# Altium schematic sheet SENSE_MUXES.SchDoc: =DocumentName
size C; SheetNumber: 5; SheetTotal: 8
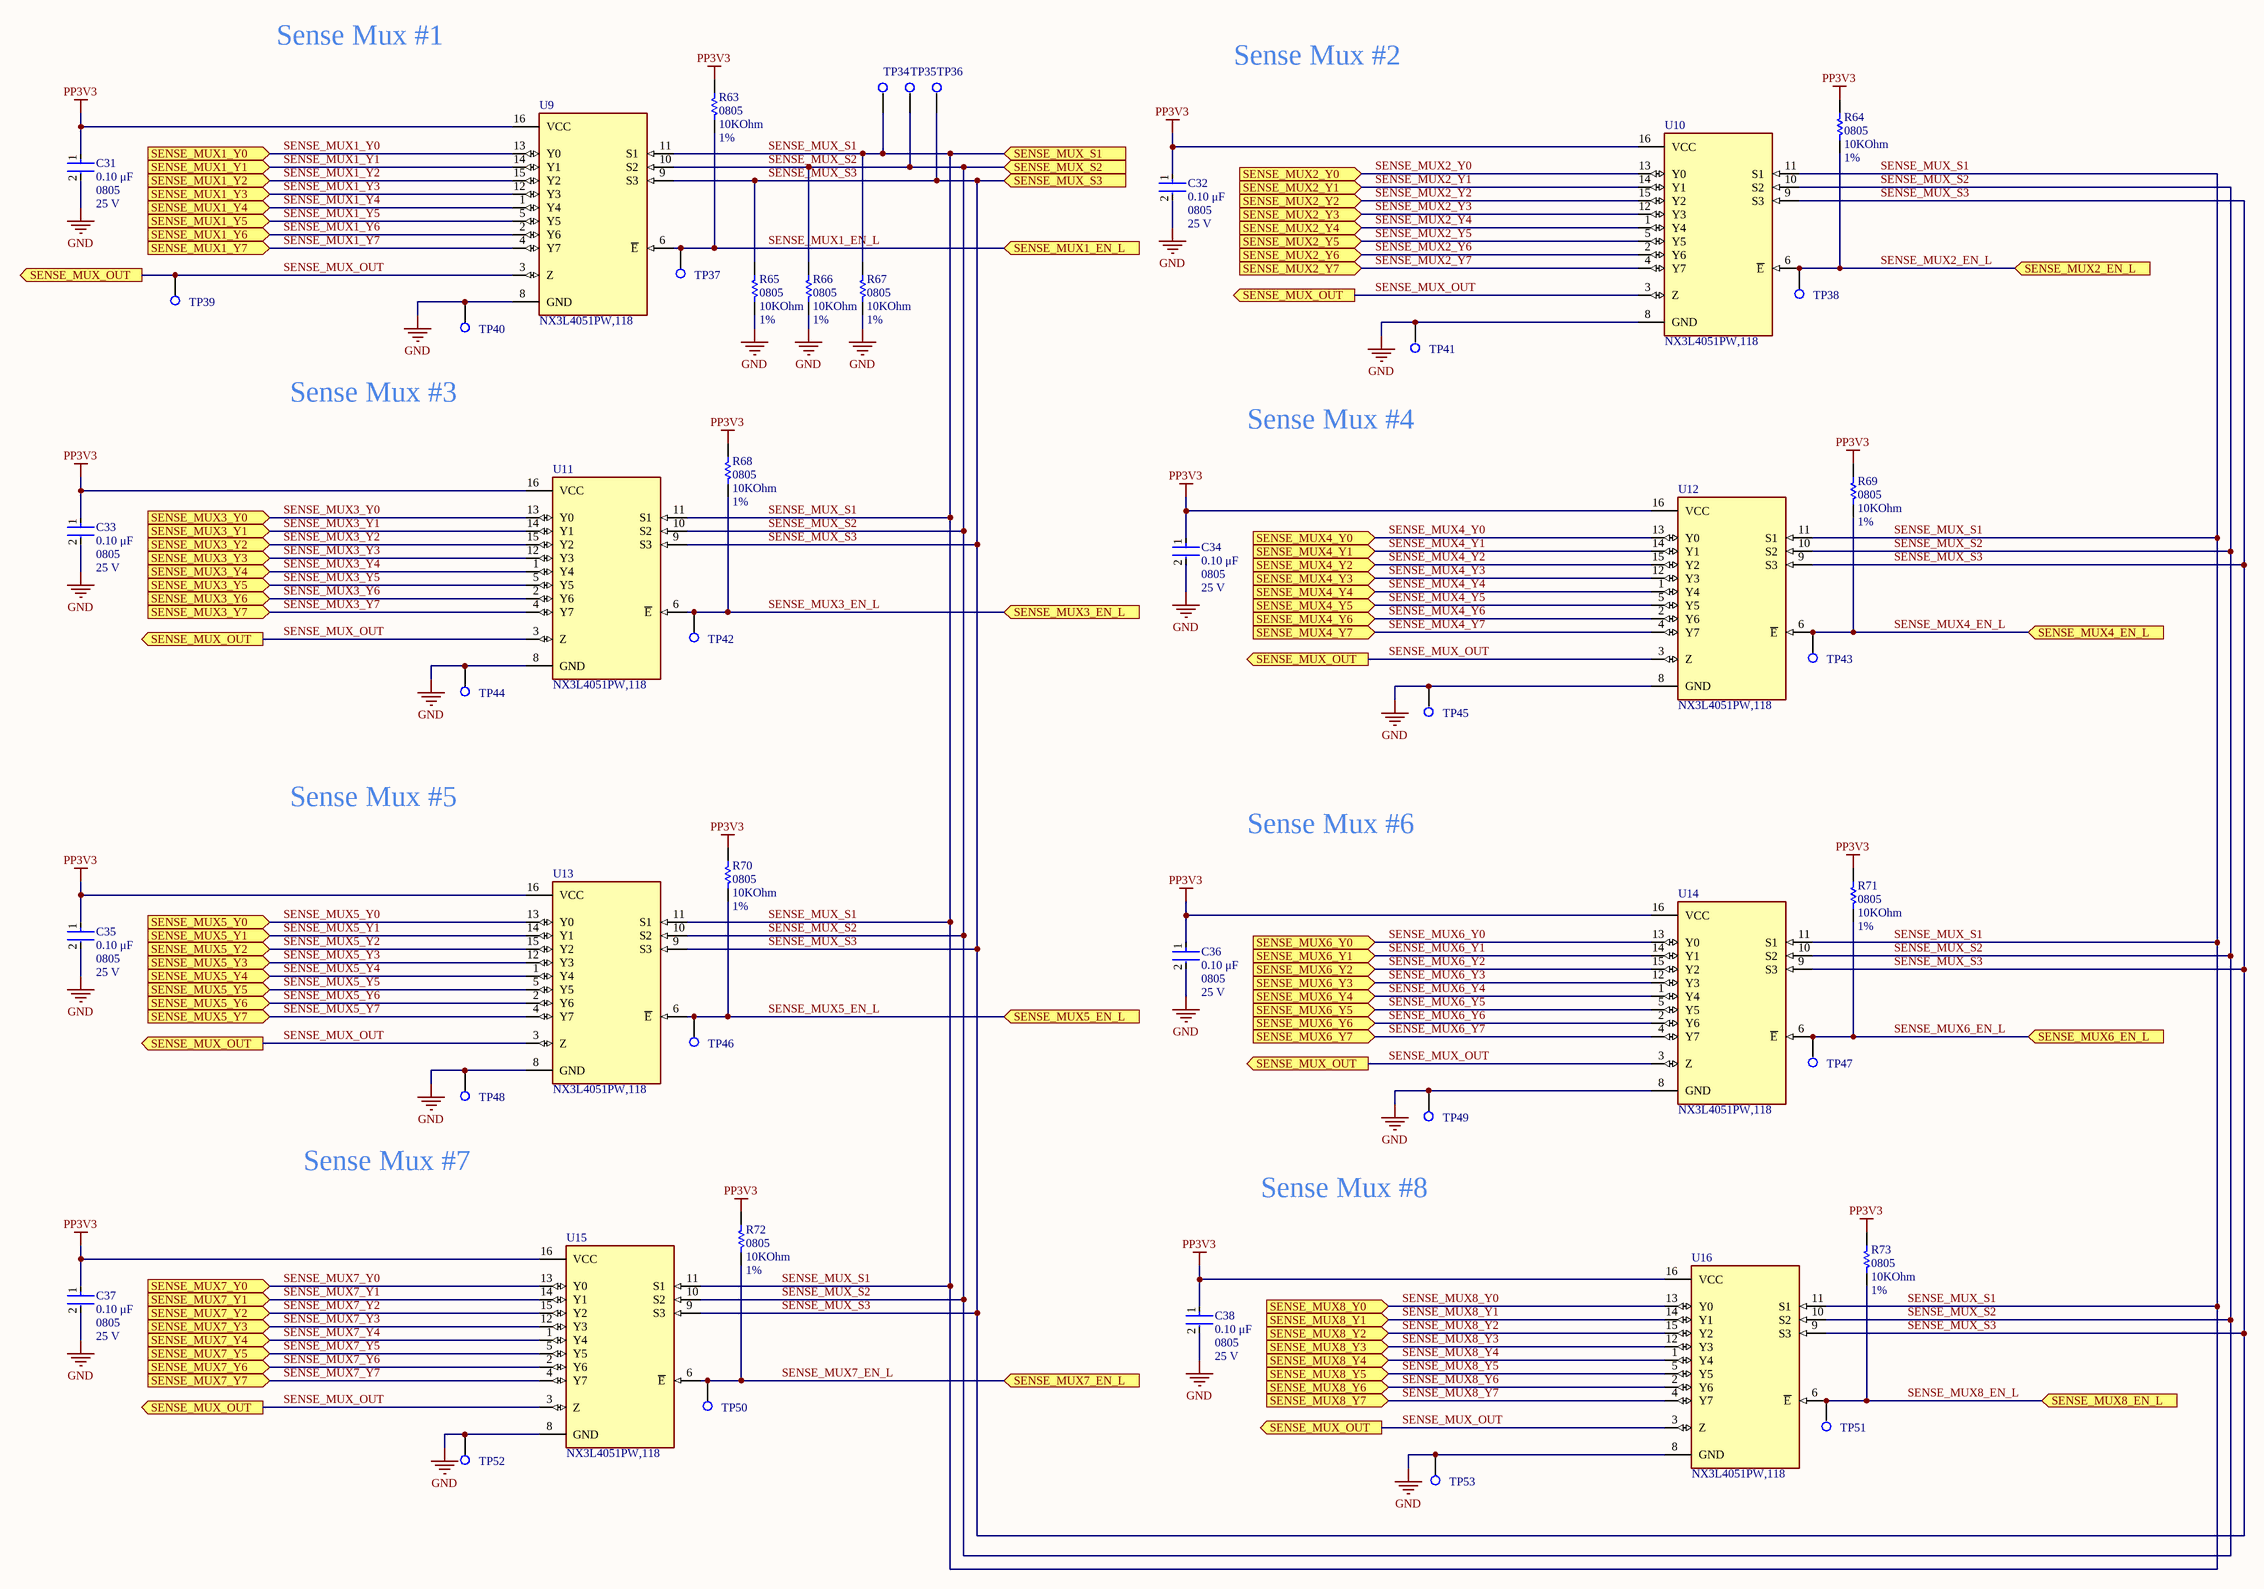
[diagram p0: SENSE_MUXES.SchDoc]

## Parts
C31  Capacitance: 0.10 μF  Package: 0805  Voltage Rating: 25 V  [FP-C0805C-DN-IPC_B]  (hidden comment: C0805C104M3RACTU)
C32  Capacitance: 0.10 μF  Package: 0805  Voltage Rating: 25 V  [FP-C0805C-DN-IPC_B]  (hidden comment: C0805C104M3RACTU)
C33  Capacitance: 0.10 μF  Package: 0805  Voltage Rating: 25 V  [FP-C0805C-DN-IPC_B]  (hidden comment: C0805C104M3RACTU)
C34  Capacitance: 0.10 μF  Package: 0805  Voltage Rating: 25 V  [FP-C0805C-DN-IPC_B]  (hidden comment: C0805C104M3RACTU)
C35  Capacitance: 0.10 μF  Package: 0805  Voltage Rating: 25 V  [FP-C0805C-DN-IPC_B]  (hidden comment: C0805C104M3RACTU)
C36  Capacitance: 0.10 μF  Package: 0805  Voltage Rating: 25 V  [FP-C0805C-DN-IPC_B]  (hidden comment: C0805C104M3RACTU)
C37  Capacitance: 0.10 μF  Package: 0805  Voltage Rating: 25 V  [FP-C0805C-DN-IPC_B]  (hidden comment: C0805C104M3RACTU)
C38  Capacitance: 0.10 μF  Package: 0805  Voltage Rating: 25 V  [FP-C0805C-DN-IPC_B]  (hidden comment: C0805C104M3RACTU)
R63  value 10KOhm  Package Reference: 0805  Tolerance: 1%  [RESC2013X50X30ML20T20]  (hidden comment: CRCW080515K0FKTA)
R64  value 10KOhm  Package Reference: 0805  Tolerance: 1%  [RESC2013X50X30ML20T20]  (hidden comment: CRCW080515K0FKTA)
R65  value 10KOhm  Package Reference: 0805  Tolerance: 1%  [RESC2013X50X30ML20T20]  (hidden comment: CRCW080515K0FKTA)
R66  value 10KOhm  Package Reference: 0805  Tolerance: 1%  [RESC2013X50X30ML20T20]  (hidden comment: CRCW080515K0FKTA)
R67  value 10KOhm  Package Reference: 0805  Tolerance: 1%  [RESC2013X50X30ML20T20]  (hidden comment: CRCW080515K0FKTA)
R68  value 10KOhm  Package Reference: 0805  Tolerance: 1%  [RESC2013X50X30ML20T20]  (hidden comment: CRCW080515K0FKTA)
R69  value 10KOhm  Package Reference: 0805  Tolerance: 1%  [RESC2013X50X30ML20T20]  (hidden comment: CRCW080515K0FKTA)
R70  value 10KOhm  Package Reference: 0805  Tolerance: 1%  [RESC2013X50X30ML20T20]  (hidden comment: CRCW080515K0FKTA)
R71  value 10KOhm  Package Reference: 0805  Tolerance: 1%  [RESC2013X50X30ML20T20]  (hidden comment: CRCW080515K0FKTA)
R72  value 10KOhm  Package Reference: 0805  Tolerance: 1%  [RESC2013X50X30ML20T20]  (hidden comment: CRCW080515K0FKTA)
R73  value 10KOhm  Package Reference: 0805  Tolerance: 1%  [RESC2013X50X30ML20T20]  (hidden comment: CRCW080515K0FKTA)
TP34  RCU-0C  [TP+195X110]  (value not drawn)
TP35  RCU-0C  [TP+195X110]  (value not drawn)
TP36  RCU-0C  [TP+195X110]  (value not drawn)
TP37  RCU-0C  [TP+195X110]  (value not drawn)
TP38  RCU-0C  [TP+195X110]  (value not drawn)
TP39  RCU-0C  [TP+195X110]  (value not drawn)
TP40  RCU-0C  [TP+195X110]  (value not drawn)
TP41  RCU-0C  [TP+195X110]  (value not drawn)
TP42  RCU-0C  [TP+195X110]  (value not drawn)
TP43  RCU-0C  [TP+195X110]  (value not drawn)
TP44  RCU-0C  [TP+195X110]  (value not drawn)
TP45  RCU-0C  [TP+195X110]  (value not drawn)
TP46  RCU-0C  [TP+195X110]  (value not drawn)
TP47  RCU-0C  [TP+195X110]  (value not drawn)
TP48  RCU-0C  [TP+195X110]  (value not drawn)
TP49  RCU-0C  [TP+195X110]  (value not drawn)
TP50  RCU-0C  [TP+195X110]  (value not drawn)
TP51  RCU-0C  [TP+195X110]  (value not drawn)
TP52  RCU-0C  [TP+195X110]  (value not drawn)
TP53  RCU-0C  [TP+195X110]  (value not drawn)
U9  NX3L4051PW,118  [SOP65P640X110-16N - duplicate]
U10  NX3L4051PW,118  [SOP65P640X110-16N - duplicate]
U11  NX3L4051PW,118  [SOP65P640X110-16N - duplicate]
U12  NX3L4051PW,118  [SOP65P640X110-16N - duplicate]
U13  NX3L4051PW,118  [SOP65P640X110-16N - duplicate]
U14  NX3L4051PW,118  [SOP65P640X110-16N - duplicate]
U15  NX3L4051PW,118  [SOP65P640X110-16N - duplicate]
U16  NX3L4051PW,118  [SOP65P640X110-16N - duplicate]

## Ports
SENSE_MUX1_EN_L (in), SENSE_MUX1_Y0 (in), SENSE_MUX1_Y1 (in), SENSE_MUX1_Y2 (in), SENSE_MUX1_Y3 (in), SENSE_MUX1_Y4 (in), SENSE_MUX1_Y5 (in), SENSE_MUX1_Y6 (in), SENSE_MUX1_Y7 (in), SENSE_MUX2_EN_L (in), SENSE_MUX2_Y0 (in), SENSE_MUX2_Y1 (in), SENSE_MUX2_Y2 (in), SENSE_MUX2_Y3 (in), SENSE_MUX2_Y4 (in), SENSE_MUX2_Y5 (in), SENSE_MUX2_Y6 (in), SENSE_MUX2_Y7 (in), SENSE_MUX3_EN_L (in), SENSE_MUX3_Y0 (in), SENSE_MUX3_Y1 (in), SENSE_MUX3_Y2 (in), SENSE_MUX3_Y3 (in), SENSE_MUX3_Y4 (in), SENSE_MUX3_Y5 (in), SENSE_MUX3_Y6 (in), SENSE_MUX3_Y7 (in), SENSE_MUX4_EN_L (in), SENSE_MUX4_Y0 (in), SENSE_MUX4_Y1 (in), SENSE_MUX4_Y2 (in), SENSE_MUX4_Y3 (in), SENSE_MUX4_Y4 (in), SENSE_MUX4_Y5 (in), SENSE_MUX4_Y6 (in), SENSE_MUX4_Y7 (in), SENSE_MUX5_EN_L (in), SENSE_MUX5_Y0 (in), SENSE_MUX5_Y1 (in), SENSE_MUX5_Y2 (in), SENSE_MUX5_Y3 (in), SENSE_MUX5_Y4 (in), SENSE_MUX5_Y5 (in), SENSE_MUX5_Y6 (in), SENSE_MUX5_Y7 (in), SENSE_MUX6_EN_L (in), SENSE_MUX6_Y0 (in), SENSE_MUX6_Y1 (in), SENSE_MUX6_Y2 (in), SENSE_MUX6_Y3 (in), SENSE_MUX6_Y4 (in), SENSE_MUX6_Y5 (in), SENSE_MUX6_Y6 (in), SENSE_MUX6_Y7 (in), SENSE_MUX7_EN_L (in), SENSE_MUX7_Y0 (in), SENSE_MUX7_Y1 (in), SENSE_MUX7_Y2 (in), SENSE_MUX7_Y3 (in), SENSE_MUX7_Y4 (in), SENSE_MUX7_Y5 (in), SENSE_MUX7_Y6 (in), SENSE_MUX7_Y7 (in), SENSE_MUX8_EN_L (in), SENSE_MUX8_Y0 (in), SENSE_MUX8_Y1 (in), SENSE_MUX8_Y2 (in), SENSE_MUX8_Y3 (in), SENSE_MUX8_Y4 (in), SENSE_MUX8_Y5 (in), SENSE_MUX8_Y6 (in), SENSE_MUX8_Y7 (in), SENSE_MUX_OUT (out), SENSE_MUX_S1 (in), SENSE_MUX_S2 (in), SENSE_MUX_S3 (in)

## Nets
GND: C31.2 C32.2 C33.2 C34.2 C35.2 C36.2 C37.2 C38.2 R65.1 R66.1 R67.1 TP40.1 TP41.1 TP44.1 TP45.1 TP48.1 TP49.1 TP52.1 TP53.1 U9.8(GND) U10.8(GND) U11.8(GND) U12.8(GND) U13.8(GND) U14.8(GND) U15.8(GND) U16.8(GND)
PP3V3: C31.1 C32.1 C33.1 C34.1 C35.1 C36.1 C37.1 C38.1 R63.2 R64.2 R68.2 R69.2 R70.2 R71.2 R72.2 R73.2 U9.16(VCC) U10.16(VCC) U11.16(VCC) U12.16(VCC) U13.16(VCC) U14.16(VCC) U15.16(VCC) U16.16(VCC)
SENSE_MUX1_EN_L: R63.1 TP37.1 U9.6(~{E}) ; port SENSE_MUX1_EN_L
SENSE_MUX1_Y0: U9.13(Y0) ; port SENSE_MUX1_Y0
SENSE_MUX1_Y1: U9.14(Y1) ; port SENSE_MUX1_Y1
SENSE_MUX1_Y2: U9.15(Y2) ; port SENSE_MUX1_Y2
SENSE_MUX1_Y3: U9.12(Y3) ; port SENSE_MUX1_Y3
SENSE_MUX1_Y4: U9.1(Y4) ; port SENSE_MUX1_Y4
SENSE_MUX1_Y5: U9.5(Y5) ; port SENSE_MUX1_Y5
SENSE_MUX1_Y6: U9.2(Y6) ; port SENSE_MUX1_Y6
SENSE_MUX1_Y7: U9.4(Y7) ; port SENSE_MUX1_Y7
SENSE_MUX2_EN_L: R64.1 TP38.1 U10.6(~{E}) ; port SENSE_MUX2_EN_L
SENSE_MUX2_Y0: U10.13(Y0) ; port SENSE_MUX2_Y0
SENSE_MUX2_Y1: U10.14(Y1) ; port SENSE_MUX2_Y1
SENSE_MUX2_Y2: U10.15(Y2) ; port SENSE_MUX2_Y2
SENSE_MUX2_Y3: U10.12(Y3) ; port SENSE_MUX2_Y3
SENSE_MUX2_Y4: U10.1(Y4) ; port SENSE_MUX2_Y4
SENSE_MUX2_Y5: U10.5(Y5) ; port SENSE_MUX2_Y5
SENSE_MUX2_Y6: U10.2(Y6) ; port SENSE_MUX2_Y6
SENSE_MUX2_Y7: U10.4(Y7) ; port SENSE_MUX2_Y7
SENSE_MUX3_EN_L: R68.1 TP42.1 U11.6(~{E}) ; port SENSE_MUX3_EN_L
SENSE_MUX3_Y0: U11.13(Y0) ; port SENSE_MUX3_Y0
SENSE_MUX3_Y1: U11.14(Y1) ; port SENSE_MUX3_Y1
SENSE_MUX3_Y2: U11.15(Y2) ; port SENSE_MUX3_Y2
SENSE_MUX3_Y3: U11.12(Y3) ; port SENSE_MUX3_Y3
SENSE_MUX3_Y4: U11.1(Y4) ; port SENSE_MUX3_Y4
SENSE_MUX3_Y5: U11.5(Y5) ; port SENSE_MUX3_Y5
SENSE_MUX3_Y6: U11.2(Y6) ; port SENSE_MUX3_Y6
SENSE_MUX3_Y7: U11.4(Y7) ; port SENSE_MUX3_Y7
SENSE_MUX4_EN_L: R69.1 TP43.1 U12.6(~{E}) ; port SENSE_MUX4_EN_L
SENSE_MUX4_Y0: U12.13(Y0) ; port SENSE_MUX4_Y0
SENSE_MUX4_Y1: U12.14(Y1) ; port SENSE_MUX4_Y1
SENSE_MUX4_Y2: U12.15(Y2) ; port SENSE_MUX4_Y2
SENSE_MUX4_Y3: U12.12(Y3) ; port SENSE_MUX4_Y3
SENSE_MUX4_Y4: U12.1(Y4) ; port SENSE_MUX4_Y4
SENSE_MUX4_Y5: U12.5(Y5) ; port SENSE_MUX4_Y5
SENSE_MUX4_Y6: U12.2(Y6) ; port SENSE_MUX4_Y6
SENSE_MUX4_Y7: U12.4(Y7) ; port SENSE_MUX4_Y7
SENSE_MUX5_EN_L: R70.1 TP46.1 U13.6(~{E}) ; port SENSE_MUX5_EN_L
SENSE_MUX5_Y0: U13.13(Y0) ; port SENSE_MUX5_Y0
SENSE_MUX5_Y1: U13.14(Y1) ; port SENSE_MUX5_Y1
SENSE_MUX5_Y2: U13.15(Y2) ; port SENSE_MUX5_Y2
SENSE_MUX5_Y3: U13.12(Y3) ; port SENSE_MUX5_Y3
SENSE_MUX5_Y4: U13.1(Y4) ; port SENSE_MUX5_Y4
SENSE_MUX5_Y5: U13.5(Y5) ; port SENSE_MUX5_Y5
SENSE_MUX5_Y6: U13.2(Y6) ; port SENSE_MUX5_Y6
SENSE_MUX5_Y7: U13.4(Y7) ; port SENSE_MUX5_Y7
SENSE_MUX6_EN_L: R71.1 TP47.1 U14.6(~{E}) ; port SENSE_MUX6_EN_L
SENSE_MUX6_Y0: U14.13(Y0) ; port SENSE_MUX6_Y0
SENSE_MUX6_Y1: U14.14(Y1) ; port SENSE_MUX6_Y1
SENSE_MUX6_Y2: U14.15(Y2) ; port SENSE_MUX6_Y2
SENSE_MUX6_Y3: U14.12(Y3) ; port SENSE_MUX6_Y3
SENSE_MUX6_Y4: U14.1(Y4) ; port SENSE_MUX6_Y4
SENSE_MUX6_Y5: U14.5(Y5) ; port SENSE_MUX6_Y5
SENSE_MUX6_Y6: U14.2(Y6) ; port SENSE_MUX6_Y6
SENSE_MUX6_Y7: U14.4(Y7) ; port SENSE_MUX6_Y7
SENSE_MUX7_EN_L: R72.1 TP50.1 U15.6(~{E}) ; port SENSE_MUX7_EN_L
SENSE_MUX7_Y0: U15.13(Y0) ; port SENSE_MUX7_Y0
SENSE_MUX7_Y1: U15.14(Y1) ; port SENSE_MUX7_Y1
SENSE_MUX7_Y2: U15.15(Y2) ; port SENSE_MUX7_Y2
SENSE_MUX7_Y3: U15.12(Y3) ; port SENSE_MUX7_Y3
SENSE_MUX7_Y4: U15.1(Y4) ; port SENSE_MUX7_Y4
SENSE_MUX7_Y5: U15.5(Y5) ; port SENSE_MUX7_Y5
SENSE_MUX7_Y6: U15.2(Y6) ; port SENSE_MUX7_Y6
SENSE_MUX7_Y7: U15.4(Y7) ; port SENSE_MUX7_Y7
SENSE_MUX8_EN_L: R73.1 TP51.1 U16.6(~{E}) ; port SENSE_MUX8_EN_L
SENSE_MUX8_Y0: U16.13(Y0) ; port SENSE_MUX8_Y0
SENSE_MUX8_Y1: U16.14(Y1) ; port SENSE_MUX8_Y1
SENSE_MUX8_Y2: U16.15(Y2) ; port SENSE_MUX8_Y2
SENSE_MUX8_Y3: U16.12(Y3) ; port SENSE_MUX8_Y3
SENSE_MUX8_Y4: U16.1(Y4) ; port SENSE_MUX8_Y4
SENSE_MUX8_Y5: U16.5(Y5) ; port SENSE_MUX8_Y5
SENSE_MUX8_Y6: U16.2(Y6) ; port SENSE_MUX8_Y6
SENSE_MUX8_Y7: U16.4(Y7) ; port SENSE_MUX8_Y7
SENSE_MUX_OUT: TP39.1 U9.3(Z) U10.3(Z) U11.3(Z) U12.3(Z) U13.3(Z) U14.3(Z) U15.3(Z) U16.3(Z) ; port SENSE_MUX_OUT
SENSE_MUX_S1: R67.2 TP34.1 U9.11(S1) U10.11(S1) U11.11(S1) U12.11(S1) U13.11(S1) U14.11(S1) U15.11(S1) U16.11(S1) ; port SENSE_MUX_S1
SENSE_MUX_S2: R66.2 TP35.1 U9.10(S2) U10.10(S2) U11.10(S2) U12.10(S2) U13.10(S2) U14.10(S2) U15.10(S2) U16.10(S2) ; port SENSE_MUX_S2
SENSE_MUX_S3: R65.2 TP36.1 U9.9(S3) U10.9(S3) U11.9(S3) U12.9(S3) U13.9(S3) U14.9(S3) U15.9(S3) U16.9(S3) ; port SENSE_MUX_S3

## Notes on the sheet
- Sense Mux #1
- Sense Mux #2
- Sense Mux #3
- Sense Mux #4
- Sense Mux #5
- Sense Mux #6
- Sense Mux #7
- Sense Mux #8
- Title
- Size:
- Date:
- File:
- C
- Number:
- Time:
- Revision:
- Sheet
- of

## Library data of the parts
C31-C38 = CMP-2007-00282-2: CAP CER 0.1UF 25V 20% X7R 0805; Manufacturer: KEMET; Temperature Coefficient: 30ppm/°C; Material: Ceramic; Tolerance: 0.2; Value: 0.10 μF; Digikey Description: CAP CER 0.1UF 25V 20% X7R 0805; Device Class L2: Capacitors; Temperature: -55°C to +125°C; Device Class L1: Passive Components; ComponentLink2Description: Datasheet; Mouser Description: Multilayer Ceramic Capacitors MLCC - SMD/SMT 25volts 0.1uF X7R 20%; Temperature Range High: +125°C; Device Class L3: Ceramic Capacitors; Automotive: No; Temperature Range Low: -55°C; RoHS: TRUE; Category: Cap; Lead Free: Yes; Ipc Land Pattern Name: CAPC200125X78; Height: 0.88mm; Temperature Characteristic: X7R; Octopart: https://octopart.com/c0805c104m3ractu-kemet-9138612; ComponentLink2URL: https://content.kemet.com/datasheets/KEM_C1003_C0G_SMD.pdf; Manufacturer Part Number: C0805C104M3RACTU; Supplier: Digi-Key; Supplier Part Number: 399-C0805C104M3RAC7800CT-ND
R63-R73 = CMP-2001-04968-1: Manufacturer: Vishay Dale; Manufacturer Part Number: CRCW080515K0FKTA; Supplier: Digi-Key; Supplier Part Number: 541-3019-1-ND
TP34-TP53 = RCU-0C: Natural PC Test Point , Plating Surface Mount Mounting Type; Manufacturer: TE Connectivity AMP Connectors; Value: *; Package: SON-6 TE Connectivity AMP Connectors; Purchase-URL: https://pricing.snapeda.com/search/part/RCU-0C/?ref=eda; Supplier Part Number: A106145CT-ND; Check_prices: https://www.snapeda.com/parts/RCU-0C/TE%20Connectivity/view-part/4791537/?ref=eda; Manufacturer Part Number: RCU-0C; SnapEDA_Link: https://www.snapeda.com/parts/RCU-0C/TE%20Connectivity/view-part/4791537/?ref=snap; Supplier: Digi-Key
U9-U16 = NX3L4051PW,118: 1 Circuit IC Switch 8:1 750mOhm 16-TSSOP; Manufacturer: NXP USA Inc.; MF: NXP USA; Check_prices: https://www.snapeda.com/parts/NX3L4051PW,118/NXP%20USA%20Inc./view-part/648693/?ref=eda; SnapEDA_Link: https://www.snapeda.com/parts/NX3L4051PW,118/NXP%20USA%20Inc./view-part/648693/?ref=snap; Package: TSSOP-16 NXP USA; MP: NX3L4051PW,118; Value: *; Digi-Key_Part_Number: 568-12393-1-ND; Purchase-URL: https://pricing.snapeda.com/search/part/NX3L4051PW,118/?ref=eda; Manufacturer Part Number: NX3L4051PW,118; Supplier: Digi-Key; Supplier Part Number: 568-12393-1-ND